# Altium project MB1189.PrjPCB (part 2 of 2)
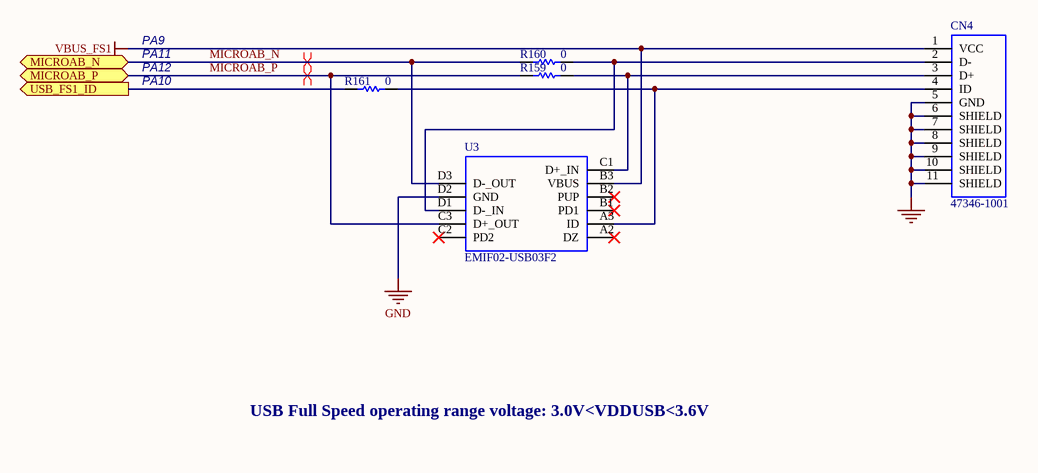
[diagram p8: USB_OTG_FS.SchDoc]

## Nets that join several sheets
+3V3: Memory (28 pins), Peripherals (14 pins), Power (6 pins), MCU (45 pins), DSI_LCD (15 pins), QSPI (C62.1 R55.2 U5.8)
GND: Memory (28 pins), Peripherals (19 pins), Power (19 pins), MCU (55 pins), DSI_LCD (26 pins), QSPI (C62.2 U5.4), USB_OTG_FS (8 pins)
VBUS_FS1: Power (D4.1), MCU (U14.E15), USB_OTG_FS (CN4.1 U3.B3)
A0: Memory (U4.G8), MCU (U14.D2)
A1: Memory (U4.G9), MCU (U14.E2)
A2: Memory (U4.F7), MCU (U14.G2)
A3: Memory (U4.F3), MCU (U14.H2)
A4: Memory (U4.G1), MCU (U14.J2)
A5: Memory (U4.G2), MCU (U14.K3)
A6: Memory (U4.G3), MCU (U14.M6)
A7: Memory (U4.H1), MCU (U14.N6)
A8: Memory (U4.H2), MCU (U14.P6)
A9: Memory (U4.J3), MCU (U14.M8)
A10: Memory (U4.G7), MCU (U14.N7)
A11: Memory (U4.H9), MCU (U14.M7)
A14: Memory (U4.J7), MCU (U14.N12)
A15: Memory (U4.H8), MCU (U14.N11)
BATMS: Power (Rdiv1.1 Rdiv2.2), MCU (U14.A8)
BATMS_EN: Power (STBC.C2), MCU (U14.B10)
CAM_PWDN: Peripherals (CN3.17), MCU (U14.P5)
CAM_RST: Peripherals (CN3.9 R7.1), MCU (U14.N5)
D0: Memory (U4.R8), MCU (U14.L12)
D1: Memory (U4.N7), MCU (U14.K13)
D2: Memory (U4.R9), MCU (U14.B12)
D3: Memory (U4.N8), MCU (U14.C12)
D4: Memory (U4.P9), MCU (U14.R8)
D5: Memory (U4.M8), MCU (U14.N9)
D6: Memory (U4.M7), MCU (U14.P9)
D7: Memory (U4.L8), MCU (U14.R9)
D8: Memory (U4.L2), MCU (U14.P10)
D9: Memory (U4.M3), MCU (U14.R10)
D10: Memory (U4.M2), MCU (U14.R12)
D11: Memory (U4.P1), MCU (U14.P11)
D12: Memory (U4.N2), MCU (U14.R11)
D13: Memory (U4.R1), MCU (U14.L15)
D14: Memory (U4.N3), MCU (U14.L14)
D15: Memory (U4.R2), MCU (U14.K15)
D16: Memory (U4.E8), MCU (U14.P14)
D17: Memory (U4.D7), MCU (U14.N14)
D18: Memory (U4.D8), MCU (U14.P15)
D19: Memory (U4.B9), MCU (U14.N15)
D20: Memory (U4.C8), MCU (U14.M15)
D21: Memory (U4.A9), MCU (U14.E12)
D22: Memory (U4.C7), MCU (U14.E13)
D23: Memory (U4.A8), MCU (U14.D13)
D24: Memory (U4.A2), MCU (U14.E14)
D25: Memory (U4.C3), MCU (U14.D14)
D26: Memory (U4.A1), MCU (U14.C14)
D27: Memory (U4.C2), MCU (U14.C13)
D28: Memory (U4.B1), MCU (U14.D6)
D29: Memory (U4.D2), MCU (U14.D4)
D30: Memory (U4.D3), MCU (U14.E4)
D31: Memory (U4.E2), MCU (U14.D5)
DSI_CK_N: MCU (U14.H13), DSI_LCD (CN10.20)
DSI_CK_P: MCU (U14.H12), DSI_LCD (CN10.19)
DSI_D0_N: MCU (U14.J13), DSI_LCD (CN10.17)
DSI_D0_P: MCU (U14.J12), DSI_LCD (CN10.16)
DSI_D1_N: MCU (U14.F13), DSI_LCD (CN10.14)
DSI_D1_P: MCU (U14.F12), DSI_LCD (CN10.13)
DSI_TE: MCU (U14.P7), DSI_LCD (CN10.10)
HREF: Peripherals (CN3.15), MCU (U14.N4)
I2C1_SCL: MCU (U14.A7), DSI_LCD (R13.1 U7.6)
I2C1_SDA: MCU (U14.B4), DSI_LCD (R12.1 U7.5)
LCD_BL_CTRL: MCU (U14.R14), DSI_LCD (U13.5)
LCD_INT: MCU (U14.M14), DSI_LCD (CN2.5 R36.2)
LCD_RST: MCU (U14.N13), DSI_LCD (CN2.6 CN10.11 R34.2)
LED1: Peripherals (R2.1), MCU (U14.R15)
MICROAB_N: MCU (U14.C15), USB_OTG_FS (R160.2 U3.D3)
MICROAB_P: MCU (U14.B15), USB_OTG_FS (R159.2 U3.C3)
NetCN1_1: Peripherals (CN1.1 R3.1), MCU (U14.A10)
NetR8_2: Peripherals (R8.2), MCU (U14.R5)
NetR161_2: MCU (U14.D15), USB_OTG_FS (R161.2)
NetU4_J1: Memory (U4.J1), MCU (U14.H14)
NRST: Peripherals (C4.2 CN1.2 D2.2 R18.2), MCU (U14.J1)
PB6: MCU (U14.B6), QSPI (R55.1 U5.1)
PC0: Memory (U4.K8), MCU (U14.M2)
PCLK: Peripherals (CN3.11), MCU (U14.P3)
PE0: Memory (U4.K9), MCU (U14.A6)
PE1: Memory (U4.K1), MCU (U14.A5)
PF6: MCU (U14.K2), QSPI (U5.7)
PF7: MCU (U14.K1), QSPI (U5.3)
PF8: MCU (U14.L3), QSPI (U5.5)
PF9: MCU (U14.L2), QSPI (U5.2)
PF10: MCU (U14.L1), QSPI (U5.6)
PF11: Memory (U4.J9), MCU (U14.P8)
PG15: Memory (U4.K7), MCU (U14.B7)
PH2: Memory (U4.J2), MCU (U14.K4)
PH3: Memory (U4.J8), MCU (U14.J4)
PI4: Memory (U4.F8), MCU (U14.C3)
PI5: Memory (U4.F2), MCU (U14.D3)
POWER_GOOD: Power (BB1.8 R1.2), MCU (U14.B13)
SIO_CLK: Peripherals (CN3.7), MCU (R25.2 U14.H4)
SIO_DAT: Peripherals (CN3.5), MCU (R24.2 U14.J3)
SPI2_MISO: Peripherals (CN5.1), MCU (U14.M4)
SPI2_MOSI: Peripherals (CN5.2), MCU (U14.M3)
SPI2_NSS: Peripherals (CN5.4), MCU (U14.L13)
SPI2_SCK: Peripherals (CN5.3), MCU (U14.P12)
STBC_CEN: Power (STBC.B1), MCU (U14.A11)
STBC_CHG: Power (STBC.E1), MCU (U14.A9)
STBC_SD: Power (STBC.A1), MCU (U14.B9)
STBC_WAKEUP: Power (STBC.D2), MCU (U14.B14)
SWCLK: Peripherals (CN1.4 R5.2), MCU (U14.A14)
SWDIO: Peripherals (CN1.3 R4.1), MCU (U14.A15)
VIBRATION_MOTOR: Peripherals (R31.2), MCU (U14.A13)
VSYNC: Peripherals (CN3.13), MCU (U14.D9)
XCLK: Peripherals (CN3.34), MCU (U14.F15)
Y0: Peripherals (CN3.37), MCU (U14.H15)
Y1: Peripherals (CN3.35), MCU (U14.G15)
Y2: Peripherals (CN3.33), MCU (U14.G14)
Y3: Peripherals (CN3.31), MCU (U14.B8)
Y4: Peripherals (CN3.29), MCU (U14.A1)
Y5: Peripherals (CN3.27), MCU (U14.C11)
Y6: Peripherals (CN3.25), MCU (U14.B1)
Y7: Peripherals (CN3.23), MCU (U14.B2)
Y8: Peripherals (CN3.21), MCU (U14.P13)
Y9: Peripherals (CN3.19), MCU (U14.A12)